# Altium schematic sheet Main.SchDoc
size 203 x 101 mm
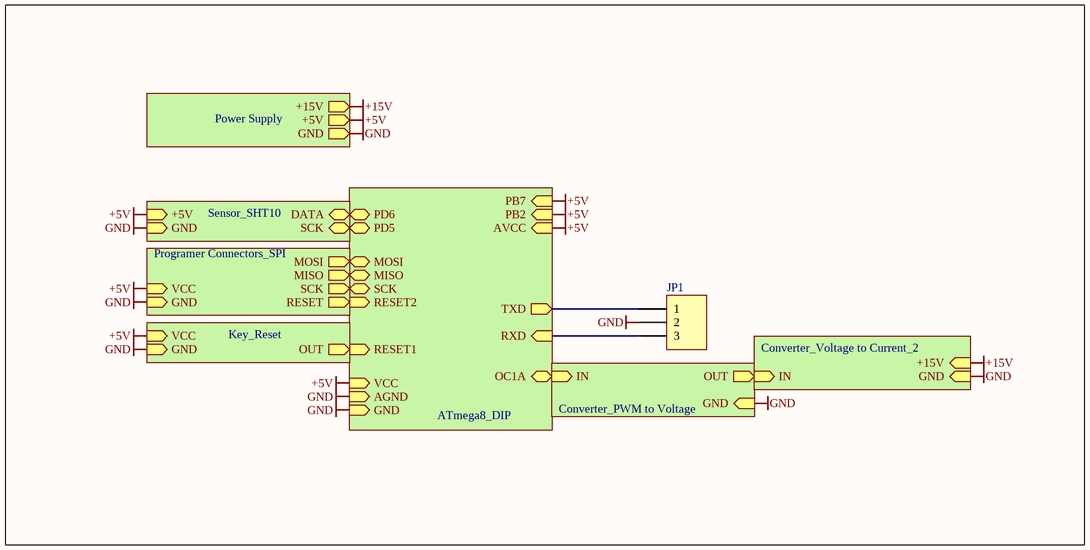
[diagram p0: Main.SchDoc]

## Parts
JP1  Header 3  [HDR1X3]  (value not drawn)

## Sub-sheets
U_ATmega8_DIP = ATmega8_DIP: GND (in), AGND (in), VCC (in), MOSI, MISO, SCK, RESET2 (in), RESET1 (in), OC1A, PD6, PD5, RXD (in), TXD (out), PB7 (in), PB2 (in), AVCC (in)
U_Converter_Voltage to Current_2 = Converter_Voltage to Current_2: GND (in), +15V (in), IN (in)
U_Key_Reset = Key_Reset: OUT (out), GND (in), VCC (in)
U_Power Supply = Power Supply: GND (out), +5V (out), +15V (out)
U_Programer Connectors_SPI = Programer Connectors_SPI: GND (in), VCC (in), RESET (out), SCK (out), MISO (out), MOSI (out)
U_PWM to Voltage = Converter_PWM to Voltage: IN (in), GND (in), OUT (out)
U_Sensor_SHT10 = Sensor_SHT10: GND (in), +5V (in), DATA, SCK

## Nets
+5V: sheet U_Power Supply/+5V, sheet U_ATmega8_DIP/VCC, sheet U_ATmega8_DIP/PB7, sheet U_ATmega8_DIP/PB2, sheet U_ATmega8_DIP/AVCC, sheet U_Key_Reset/VCC, sheet U_Programer Connectors_SPI/VCC, sheet U_Sensor_SHT10/+5V
+15V: sheet U_Power Supply/+15V, sheet U_Converter_Voltage to Current_2/+15V
GND: JP1.2 ; sheet U_Power Supply/GND, sheet U_ATmega8_DIP/GND, sheet U_ATmega8_DIP/AGND, sheet U_Key_Reset/GND, sheet U_Programer Connectors_SPI/GND, sheet U_Sensor_SHT10/GND, sheet U_PWM to Voltage/GND, sheet U_Converter_Voltage to Current_2/GND
NetJP1_1: JP1.1 ; sheet U_ATmega8_DIP/TXD
NetJP1_3: JP1.3 ; sheet U_ATmega8_DIP/RXD
(unnamed): sheet U_ATmega8_DIP/MOSI, sheet U_Programer Connectors_SPI/MOSI
(unnamed): sheet U_ATmega8_DIP/MISO, sheet U_Programer Connectors_SPI/MISO
(unnamed): sheet U_ATmega8_DIP/SCK, sheet U_Programer Connectors_SPI/SCK
(unnamed): sheet U_ATmega8_DIP/RESET2, sheet U_Programer Connectors_SPI/RESET
(unnamed): sheet U_ATmega8_DIP/RESET1, sheet U_Key_Reset/OUT
(unnamed): sheet U_ATmega8_DIP/OC1A, sheet U_PWM to Voltage/IN
(unnamed): sheet U_ATmega8_DIP/PD6, sheet U_Sensor_SHT10/DATA
(unnamed): sheet U_ATmega8_DIP/PD5, sheet U_Sensor_SHT10/SCK
(unnamed): sheet U_PWM to Voltage/OUT, sheet U_Converter_Voltage to Current_2/IN

## Library data of the parts
JP1 = Header 3: Header, 3-Pin; Manufacturer: Generic Components; Class I: Connector; Revision: July-2002: Re-released for DXP Platform.; Publisher: Altium Limited